# Altium schematic sheet PowerInFilter.SchDoc
size A4; Engineer: JBayalas; DocumentNumber: 9; Revision: V1.1; SheetNumber: 9; SheetTotal: 13
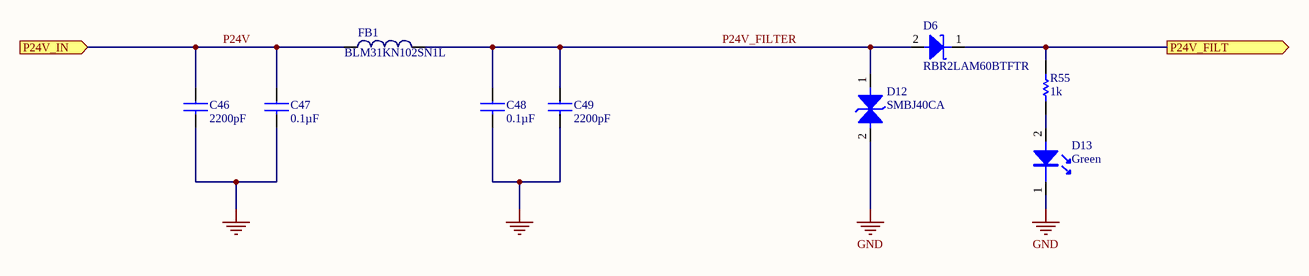
[diagram p0: PowerInFilter.SchDoc]

## Parts
C46  value 2200pF  [C0805]  (hidden comment: *)
C47  value 0.1µF  [C0805]  (hidden comment: *)
C48  value 0.1µF  [C0805]  (hidden comment: *)
C49  value 2200pF  [C0805]  (hidden comment: *)
D6  value RBR2LAM60BTFTR  [SOD128]  (hidden comment: *)
D12  value SMBJ40CA  [DO-214AA (SMBJ40CA)]  (hidden comment: *)
D13  value Green  [LED0402(GREEN)]  (hidden comment: *)
FB1  value BLM31KN102SN1L  [1206 INDUCTOR]  (hidden comment: *)
R55  value 1k  [R0603]  (hidden comment: *)

## Ports
P24V_FILT (out), P24V_IN (in)

## Nets
GND: C46.2 C47.2 C48.2 C49.2 D12.2(anode) D13.1
P24V: C46.1 C47.1 FB1.2 ; port P24V_IN
P24V_FILT: D6.1(cathode) R55.2 ; port P24V_FILT
P24V_FILTER: C48.1 C49.1 D6.2(anode) D12.1(cathode) FB1.1
NetD13_2: D13.2 R55.1

## Notes on the sheet
- Title:
- Sheet:
- Date:
- of
- Project:
- Revision:
- Engineer:
- Wi4B S.r.l

## Library data of the parts
C46 C49 = 08055C222KAT2A: CAP CER 2200PF 50V 10% X7R 0805; MFT: AVX Corporation; TYPE: Surface Mount, MLCC; FUNCTION: PwrInFilter; MPN: 08055C222KAT2A; RATING: 50V 10% X7R
C47 C48 = GCM21BR72A104KA37L: CAP CER 0.1UF 100V X7R 0805; MFT: Murata Electronics North America; TYPE: Surface Mount, MLCC; FUNCTION: PwrInFilter; MPN: GCM21BR72A104KA37L; RATING: 100V
D6 = RBR2LAM60BTFTR: AUTOMOTIVE SCHOTTKY BARRIER DIOD; MFT: Rohm; RATING: 60V 2A; TYPE: SMD; FUNCTION: PwrInFilter; MPN: RBR2LAM60BTFTR; LOAD: *
D12 = SMBJ40CA: TVS DIODE 40VWM 64.5VC DO214AA; MFT: Bourns; TYPE: SMD; FUNCTION: PwrInFilter; MPN: SMBJ40CA; RATING: *; LOAD: *
D13 = LNJ347W83RA: LED GREEN 0402 SMD; MFT: Panasonic Electronic Components; TYPE: Surface Mount; FUNCTION: PwrInFilter; MPN: LNJ347W83RA
FB1 = BLM31KN102SN1L: FERRITE BEAD 1 KOHM 1206 1LN; MFT: Murata; TYPE: SMD; RATING: 1 KOHM; FUNCTION: PwrInFilter; MPN: BLM31KN102SN1L; LOAD: *
R55 = ERJ-3EKF1001V: RES SMD 1K OHM 1% 1/10W 0603; MFT: Panasonic Electronic Components; RATING: 0.1W; FUNCTION: PwrInFilter; MPN: ERJ-3EKF1001V; TYPE: Surface Mount